# Altium schematic sheet Mach_trai_tim.SchDoc
size A; SheetNumber: 1; SheetTotal: 1
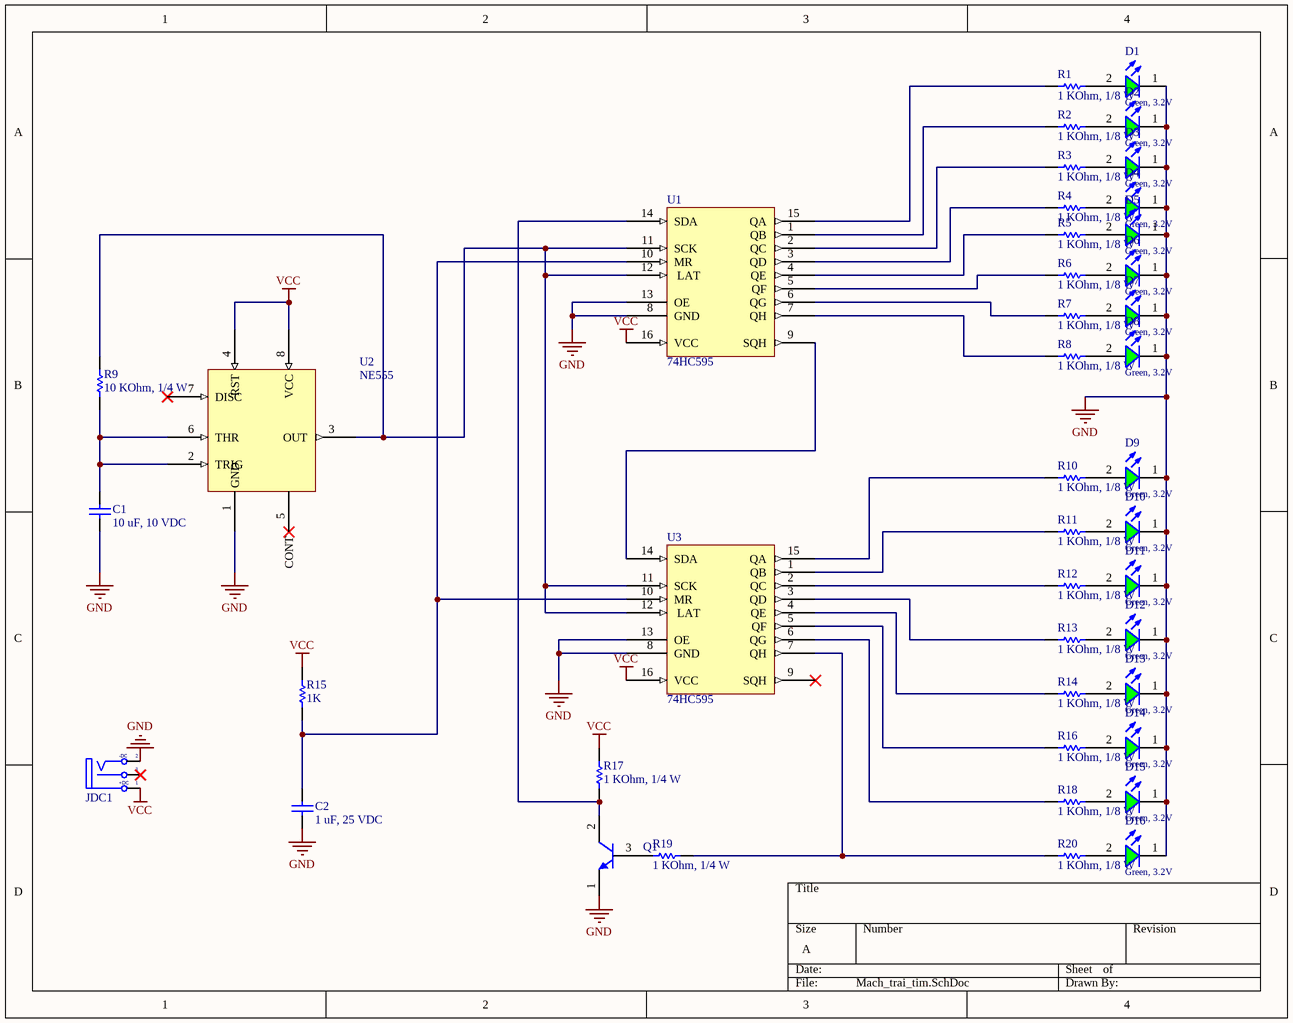
[diagram p0: Mach_trai_tim.SchDoc]

## Parts
C1  10 uF, 10 VDC  [CAP_0603]
C2  1 uF, 25 VDC  [CAP_0603]
D1  Green, 3.2V  [WL-SMCW_0805]
D2  Green, 3.2V  [WL-SMCW_0805]
D3  Green, 3.2V  [WL-SMCW_0805]
D4  Green, 3.2V  [WL-SMCW_0805]
D5  Green, 3.2V  [WL-SMCW_0805]
D6  Green, 3.2V  [WL-SMCW_0805]
D7  Green, 3.2V  [WL-SMCW_0805]
D8  Green, 3.2V  [WL-SMCW_0805]
D9  Green, 3.2V  [WL-SMCW_0805]
D10  Green, 3.2V  [WL-SMCW_0805]
D11  Green, 3.2V  [WL-SMCW_0805]
D12  Green, 3.2V  [WL-SMCW_0805]
D13  Green, 3.2V  [WL-SMCW_0805]
D14  Green, 3.2V  [WL-SMCW_0805]
D15  Green, 3.2V  [WL-SMCW_0805]
D16  Green, 3.2V  [WL-SMCW_0805]
JDC1  Jack DC  [DC-IN]  (value not drawn)
Q1  C1815  [SOT23B]  (value not drawn)
R1  1 KOhm, 1/8 W  [RESISTOR_0805]
R2  1 KOhm, 1/8 W  [RESISTOR_0805]
R3  1 KOhm, 1/8 W  [RESISTOR_0805]
R4  1 KOhm, 1/8 W  [RESISTOR_0805]
R5  1 KOhm, 1/8 W  [RESISTOR_0805]
R6  1 KOhm, 1/8 W  [RESISTOR_0805]
R7  1 KOhm, 1/8 W  [RESISTOR_0805]
R8  1 KOhm, 1/8 W  [RESISTOR_0805]
R9  10 KOhm, 1/4 W  [resistor_0603]
R10  1 KOhm, 1/8 W  [RESISTOR_0805]
R11  1 KOhm, 1/8 W  [RESISTOR_0805]
R12  1 KOhm, 1/8 W  [RESISTOR_0805]
R13  1 KOhm, 1/8 W  [RESISTOR_0805]
R14  1 KOhm, 1/8 W  [RESISTOR_0805]
R15  value 1K  [RES-SM-0603]  (hidden comment: RESISTOR SMD)
R16  1 KOhm, 1/8 W  [RESISTOR_0805]
R17  1 KOhm, 1/4 W  [resistor_0603]
R18  1 KOhm, 1/8 W  [RESISTOR_0805]
R19  1 KOhm, 1/4 W  [resistor_0603]
R20  1 KOhm, 1/8 W  [RESISTOR_0805]
U1  74HC595  [74HC595]
U2  NE555  [NE555]
U3  74HC595  [74HC595]

## Nets
GND: C1.1 C2.2 D1.1(K) D2.1(K) D3.1(K) D4.1(K) D5.1(K) D6.1(K) D7.1(K) D8.1(K) D9.1(K) D10.1(K) D11.1(K) D12.1(K) D13.1(K) D14.1(K) D15.1(K) D16.1(K) JDC1.2(TN) Q1.1(E) U1.8(GND) U1.13(OE) U2.1(GND) U3.8(GND) U3.13(OE)
VCC: JDC1.1(T) R15.2 R17.2 U1.16(VCC) U2.4(RST) U2.8(VCC) U3.16(VCC)
NetC1_2: C1.2 R9.1 U2.2(TRIG) U2.6(THR)
NetC2_1: C2.1 R15.1 U1.10(MR) U3.10(MR)
NetD1_2: D1.2(A) R1.2
NetD2_2: D2.2(A) R2.2
NetD3_2: D3.2(A) R3.2
NetD4_2: D4.2(A) R4.2
NetD5_2: D5.2(A) R5.2
NetD6_2: D6.2(A) R6.2
NetD7_2: D7.2(A) R7.2
NetD8_2: D8.2(A) R8.2
NetD9_2: D9.2(A) R10.2
NetD10_2: D10.2(A) R11.2
NetD11_2: D11.2(A) R12.2
NetD12_2: D12.2(A) R13.2
NetD13_2: D13.2(A) R14.2
NetD14_2: D14.2(A) R16.2
NetD15_2: D15.2(A) R18.2
NetD16_2: D16.2(A) R20.2
NetQ1_2: Q1.2(C) R17.1 U1.14(SDA)
NetQ1_3: Q1.3(B) R19.1
NetR1_1: R1.1 U1.15(QA)
NetR2_1: R2.1 U1.1(QB)
NetR3_1: R3.1 U1.2(QC)
NetR4_1: R4.1 U1.3(QD)
NetR5_1: R5.1 U1.4(QE)
NetR6_1: R6.1 U1.5(QF)
NetR7_1: R7.1 U1.6(QG)
NetR8_1: R8.1 U1.7(QH)
NetR9_2: R9.2 U1.11(SCK) U1.12(LAT) U2.3(OUT) U3.11(SCK) U3.12(LAT)
NetR10_1: R10.1 U3.15(QA)
NetR11_1: R11.1 U3.1(QB)
NetR12_1: R12.1 U3.2(QC)
NetR13_1: R13.1 U3.3(QD)
NetR14_1: R14.1 U3.4(QE)
NetR16_1: R16.1 U3.5(QF)
NetR18_1: R18.1 U3.6(QG)
NetR19_2: R19.2 R20.1 U3.7(QH)
NetU1_9: U1.9(SQH) U3.14(SDA)

Not connected (* = marked no-connect by the designer): JDC1 3(S)*; U2 5(CONT) 7(DISC)*; U3 9(SQH)*

## Notes on the sheet
- (in symbol Jack DC) -DC; +DC

## Library data of the parts
C1 = 0106031061010: CAP, size 0603, 10 uF, 10 VDC; Manufacture Name: Samsung Electro-Mechanics; Manufacture SN: CL10A106KP8NNWC; Capacitance: 10 uF; Tolerance: +/-10%; Voltage Rating DC: 10 VDC; ComponentLink2Description: Datasheet; ComponentLink2URL: https://www.mouser.vn/datasheet/2/585/MLCC-1837944.pdf; Operating Temperature: -55 to +125degC; Packaging: Tape and Reel; Mounting Technology: SMT; Size: 0603; Supplier 1 Name: Mouser; Supplier 1 SN: 187-CL10A106KP8NNWC; Supplier 1 URL: https://www.mouser.vn/ProductDetail/Samsung-Electro-Mechanics/CL10A106KP8NNWC?qs=xZ%2FP%252Ba9zWqZx8LSX23YqWA%3D%3D&utm_source=mouser-refine-download&utm_medium=file&utm_campaign=CL10A106KP8NNWC&utm_content=Samsung-Electro-Mechanics; Supplier 2 Name: Digi-Key; Supplier 2 SN: 1276-CL10A106KP8NNWCTR-ND; Supplier 2 URL: https://www.digikey.com/en/products/detail/samsung-electro-mechanics/cl10a106kp8nnwc/16572907; Supplier 3 Name: thegioiic; Supplier 3 SN: N/A; Supplier 3 URL: https://www.thegioiic.com/tu-gom-0603-10uf-25v; Value: 10 uF, 10 VDC
C2 = 0106031051025: CAP, size 0603, 1 uF, 25 VDC; Manufacture Name: Samsung Electro-Mechanics; Manufacture SN: CL10A105KA8NNNC; Capacitance: 1 uF; Tolerance: +/-10%; Voltage Rating DC: 25 VDC; ComponentLink2Description: Datasheet; ComponentLink2URL: https://www.mouser.vn/datasheet/2/585/MLCC-1837944.pdf; Operating Temperature: -55 to +125degC; Packaging: Tape and Reel; Mounting Technology: SMT; Size: 0603; Supplier 1 Name: Mouser; Supplier 1 SN: 187-CL10A105KA8NNNC; Supplier 1 URL: https://www.mouser.vn/ProductDetail/Samsung-Electro-Mechanics/CL10A105KA8NNNC?qs=hqM3L16%252BxldY%252BnK4KzDJVg%3D%3D&utm_source=mouser-refine-download&utm_medium=file&utm_campaign=CL10A105KA8NNNC&utm_content=Samsung-Electro-Mechanics; Supplier 2 Name: Digi-Key; Supplier 2 SN: 1276-1102-2-ND; Supplier 2 URL: https://www.digikey.com/en/products/detail/samsung-electro-mechanics/cl10a105ka8nnnc/3886760; Supplier 3 Name: thegioiic; Supplier 3 SN: N/A; Supplier 3 URL: N/A; Value: 1 uF, 25 VDC
D1-D16 = 160805GreenClear: WL-SMCW SMT Mono-color Chip LED Waterclear, size 0805, Green, 3.2V, 140deg; Type: Clear; Color: Green; Size: 0603; ComponentLink1Description: Datasheet link; ComponentLink1URL: N/A; ComponentLink2Description: Supplier 1 URL; ComponentLink2URL: https://www.mouser.vn/ProductDetail/Wurth-Elektronik/150080VS75000?qs=LlUlMxKIyB0tGHJmO6%252B0ug%3D%3D; ComponentLink3Description: Supplier 2 URL; ComponentLink3URL: https://www.digikey.com/en/products/detail/liteon/LTST-C171GKT/386793; ComponentLink4Description: Supplier 3 URL; ComponentLink4URL: https://www.thegioiic.com/led-xanh-la-0805-dan-smd-trong-suot; Supplier 1 Name: Mouser; Supplier 1 SN: 710-150080VS75000; Supplier 1 URL: https://www.mouser.vn/ProductDetail/Wurth-Elektronik/150080VS75000?qs=LlUlMxKIyB0tGHJmO6%252B0ug%3D%3D; Supplier 2 Name: Digi-Key; Supplier 2 SN: 160-1423-2-ND; Supplier 2 URL: https://www.digikey.com/en/products/detail/liteon/LTST-C171GKT/386793; Supplier 3 Name: ICDayRoi; Supplier 3 SN: N/A; Supplier 3 URL: https://www.thegioiic.com/led-xanh-la-0805-dan-smd-trong-suot; Value: Green, 3.2V
JDC1 = Jack DC: Jack DC input; Value: Jac DC
Q1 = C1815: NPN Bipolar Transistor
R1-R8 R10-R14 R16 R18 R20 = 0008051021: RES, size 0805, 1 KOhm, 1/8 W; Manufacture  Name: Vishay Dale; Manufacture  SN: M55342K06B1E00RS3; Resistance tolerance: +/-1%; Rated Power: 1/8 W; Resistance: 1 KOhm; Size: 0805; Mounting Technology: SMT; Supplier 1 Name: Mouser; Supplier 1 SN: N/A; Supplier 1 URL: N/A; Supplier 2 Name: Digi-Key; Supplier 2 SN: 1135-1001-2-ND; Supplier 2 URL: https://www.digikey.com/en/products/detail/vishay-dale/M55342K06B1E00RS3/2941798; Supplier 3 Name: Thegioiic; Supplier 3 SN: N/A; Supplier 3 URL: https://www.thegioiic.com/dien-tro-1-kohm-0805-1; Value: 1 KOhm, 1/8 W; ComponentLink1Description: Datasheet link; ComponentLink1URL: https://www.vishay.com/docs/31010/rcwpm.pdf; ComponentLink2Description: Supplier 1 URL; ComponentLink2URL: N/A; ComponentLink3Description: Supplier 2 URL; ComponentLink3URL: https://www.digikey.com/en/products/detail/vishay-dale/M55342K06B1E00RS3/2941798; ComponentLink4Description: Supplier 3 URL; ComponentLink4URL: https://www.thegioiic.com/dien-tro-1-kohm-0805-1
R9 = 0006031031: RES, size 0603, 10 KOhm, 1/4 W; Manufacture  Name: OEM; Resistance: 10 KOhm; Rated Power: 1/4 W; Resistance Tolerance: +/-1%; Size: 0603; Mounting Technology: SMT; Supplier 1 Name: Mouser; Supplier 1 SN: 755-ESR03EZPF1002; Supplier 2 Name: Digi-Key; Supplier 2 SN: RHM10KADTR-ND RHM10KADCT-ND RHM10KADDKR-ND; Supplier 1 URL: https://www.mouser.vn/ProductDetail/ROHM-Semiconductor/ESR03EZPF1002?qs=sGAEpiMZZMvdGkrng054t67Efho1F8r6CDeAsqwFse8%3D; Supplier 3 Name: thegioiic; Supplier 3 SN: N/A; Supplier 3 URL: N/A; Manufacture  SN: OEM; Value: 10 KOhm, 1/4 W; ComponentLink1Description: Datasheet link; ComponentLink1URL: https://fscdn.rohm.com/en/products/databook/datasheet/passive/resistor/chip_resistor/esr-e.pdf; ComponentLink2Description: Supplier 1 URL; ComponentLink2URL: N/A; ComponentLink3Description: Supplier 2 URL; ComponentLink3URL: https://www.digikey.com/en/products/detail/rohm-semiconductor/ESR03EZPF1002/1983429; ComponentLink4Description: Supplier 3 URL; ComponentLink4URL: N/A; Supplier 2 URL: https://www.digikey.com/en/products/detail/rohm-semiconductor/ESR03EZPF1002/1983429
R15 = RESISTOR SMD: Resistor
R17 R19 = 0006031025: RES, size 0603, 1 KOhm, 1/4 W; Manufacture  Name: Panasonic; Manufacture  SN: ERJ-UP3J102V; Rated Power: 1/4 W; Resistance: 1 KOhm; Resistance Tolerance: +/-5%; Size: 0603; Mounting Technology: SMT; Supplier 1 Name: Mouser; Supplier 1 SN: 667-ERJ-UP3J102V; Supplier 1 URL: https://www.mouser.vn/ProductDetail/Panasonic/ERJ-UP3J102V?qs=GedFDFLaBXG0ASpYP%252B3phQ%3D%3D; Supplier 2 Name: Digi-Key; Supplier 2 SN: 667-ERJ-UP3J102V; Supplier 3 Name: thegioiic; Supplier 3 SN: N/A; Supplier 3 URL: N/A; Value: 1 KOhm, 1/4 W; ComponentLink1Description: Datasheet link; ComponentLink1URL: https://www.mouser.vn/datasheet/2/315/Panasonic_Resistors_Thick_Film_Anti_Sulf_Anti_Surg-1825099.pdf; ComponentLink2Description: Supplier 1 URL; ComponentLink2URL: N/A; ComponentLink3Description: Supplier 2 URL; ComponentLink3URL: https://www.mouser.vn/ProductDetail/Panasonic/ERJ-UP3J102V?qs=GedFDFLaBXG0ASpYP%252B3phQ%3D%3D; ComponentLink4Description: Supplier 3 URL; ComponentLink4URL: N/A; Supplier 2 URL: https://www.mouser.vn/ProductDetail/Panasonic/ERJ-UP3J102V?qs=GedFDFLaBXG0ASpYP%252B3phQ%3D%3D